# EAGLE design Game of Life v2 (EAGLE 9.6.2)
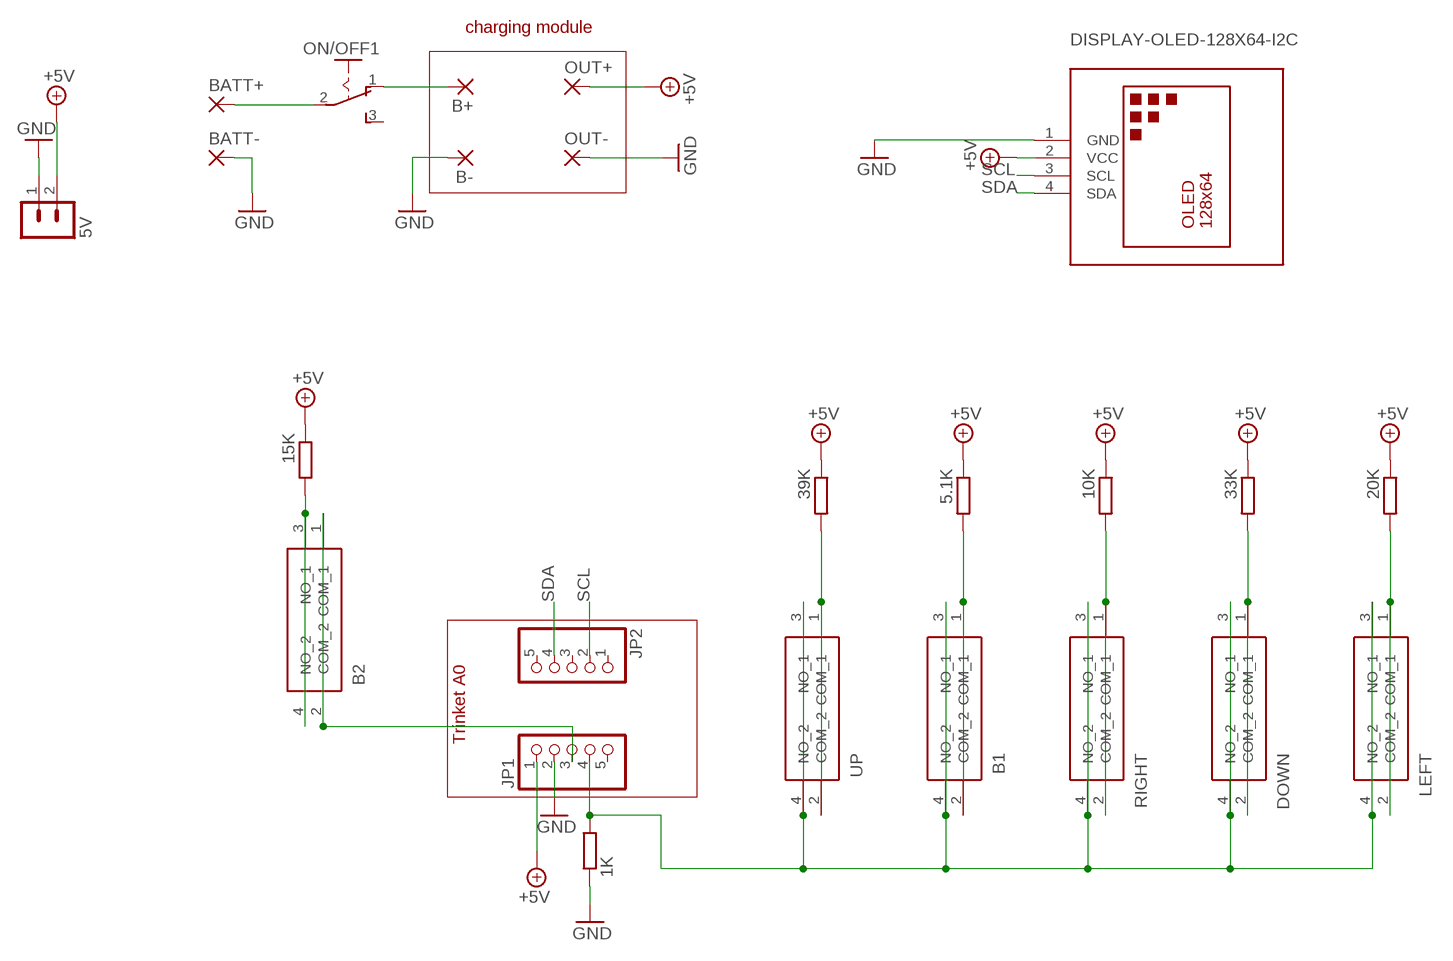
[diagram p0: schematic, sheet 1]

## Parts
5V  B2B-PH-K-S  [B2B-PH-K-S]
B1  101-0364-EV  [1010364EV]
B2  101-0364-EV  [1010364EV]
B+  SMD5  [SMD2,54-5,08]
B-  SMD5  [SMD2,54-5,08]
BATT+  SMD5  [SMD2,54-5,08]
BATT-  SMD5  [SMD2,54-5,08]
DOWN  101-0364-EV  [1010364EV]
JP1  PINHD-1X5  [1X05]
JP2  PINHD-1X5  [1X05]
LEFT  101-0364-EV  [1010364EV]
ON/OFF1  M251  [M251]
OUT+  SMD5  [SMD2,54-5,08]
OUT-  SMD5  [SMD2,54-5,08]
R1  1K  R-EU_0207/10  [0207/10]
R2  20K  R-EU_0207/10  [0207/10]
R3  39K  R-EU_0207/10  [0207/10]
R4  10K  R-EU_0207/10  [0207/10]
R5  33K  R-EU_0207/10  [0207/10]
R6  5.1K  R-EU_0207/10  [0207/10]
R7  15K  R-EU_0207/10  [0207/10]
RIGHT  101-0364-EV  [1010364EV]
U$2  DISPLAY-OLED-128X64-I2C  [DISPLAY-OLED-128X64-I2C]
UP  101-0364-EV  [1010364EV]

## Nets
+5V: 5V.2 JP1.1 OUT+.1(P) R2.1 R3.1 R4.1 R5.1 R6.1 R7.1 U$2.2(VCC)
GND: 5V.1 B-.1(P) BATT-.1(P) JP1.2 OUT-.1(P) R1.1 U$2.1(GND)
N$1: DOWN.1(COM_1) DOWN.2(COM_2) R5.2
N$2: R3.2 UP.1(COM_1) UP.2(COM_2)
N$3: R4.2 RIGHT.1(COM_1) RIGHT.2(COM_2)
N$4: B1.3(NO_1) B1.4(NO_2) DOWN.3(NO_1) DOWN.4(NO_2) JP1.4 LEFT.3(NO_1) LEFT.4(NO_2) R1.2 RIGHT.3(NO_1) RIGHT.4(NO_2) UP.3(NO_1) UP.4(NO_2)
N$5: LEFT.1(COM_1) LEFT.2(COM_2) R2.2
N$6: B1.1(COM_1) B1.2(COM_2) R6.2
N$7: B2.1(COM_1) B2.2(COM_2) JP1.3
N$8: BATT+.1(P) ON/OFF1.2(P)
N$9: B+.1(P) ON/OFF1.1(O)
N$10: B2.3(NO_1) B2.4(NO_2) R7.2
SCL: JP2.2 U$2.3(SCL)
SDA: JP2.4 U$2.4(SDA)
Unconnected: JP1.5 JP2.1 JP2.3 JP2.5 ON/OFF1.3(S)

## Notes on the sheet
- charging module
- Trinket A0

## Library data of the parts
5V = con-JST PH:B2B-PH: JST PH series header 2.00mm pitch disconnectable crimp style connectors, vertical (side entry type), 2 pins
B1 B2 DOWN LEFT RIGHT UP = Switch_Omron_SMD:101-0364-EV: Tactile Switches TACTILE SWITCH 6X6MM Source: Datasheet <https://componentsearchengine.com/Datasheets/1/101-0364-EV.pdf>; DESCRIPTION: Tactile Switches TACTILE SWITCH 6X6MM; HEIGHT: 2mm; MANUFACTURER_NAME: Mountain Switch; MANUFACTURER_PART_NUMBER: 101-0364-EV; MOUSER_PART_NUMBER: 101-0364-EV; MOUSER_PRICE-STOCK: https://www.mouser.co.uk/ProductDetail/Mountain-Switch/101-0364-EV?qs=Np9hobi9ysLawDJP688e5g%3D%3D
B+ B- BATT+ BATT- OUT+ OUT- = wirepad:SMD5: SMD PAD
JP1 JP2 = pinhead:PINHD-1X5: PIN HEADER
ON/OFF1 = switches M Dunn:M251: SLIDING SWITCH Mors, distributor Buerklin, 11G702
R1-R7 = rcl:R-EU_: RESISTOR, European symbol; SPICEPREFIX: R
U$2 = diy-modules:DISPLAY-OLED-128X64-I2C: 128x64 Dot Matrix OLED Module based on SSD1306 chip Variant with I2C interface More details available here: http://www.instructables.com/id/Monochrome-096-i2c-OLED-display-with-arduino-SSD13/ SSD1306 datasheet: https://cdn-shop.adafruit.com/datasheets/SSD1306.pdf Click here to find device on ebay.com <http://www.ebay.com/sch/oled+display+128x64+iic> Note: There are two variants: I2C and SPI. Search for the proper version.

## Board
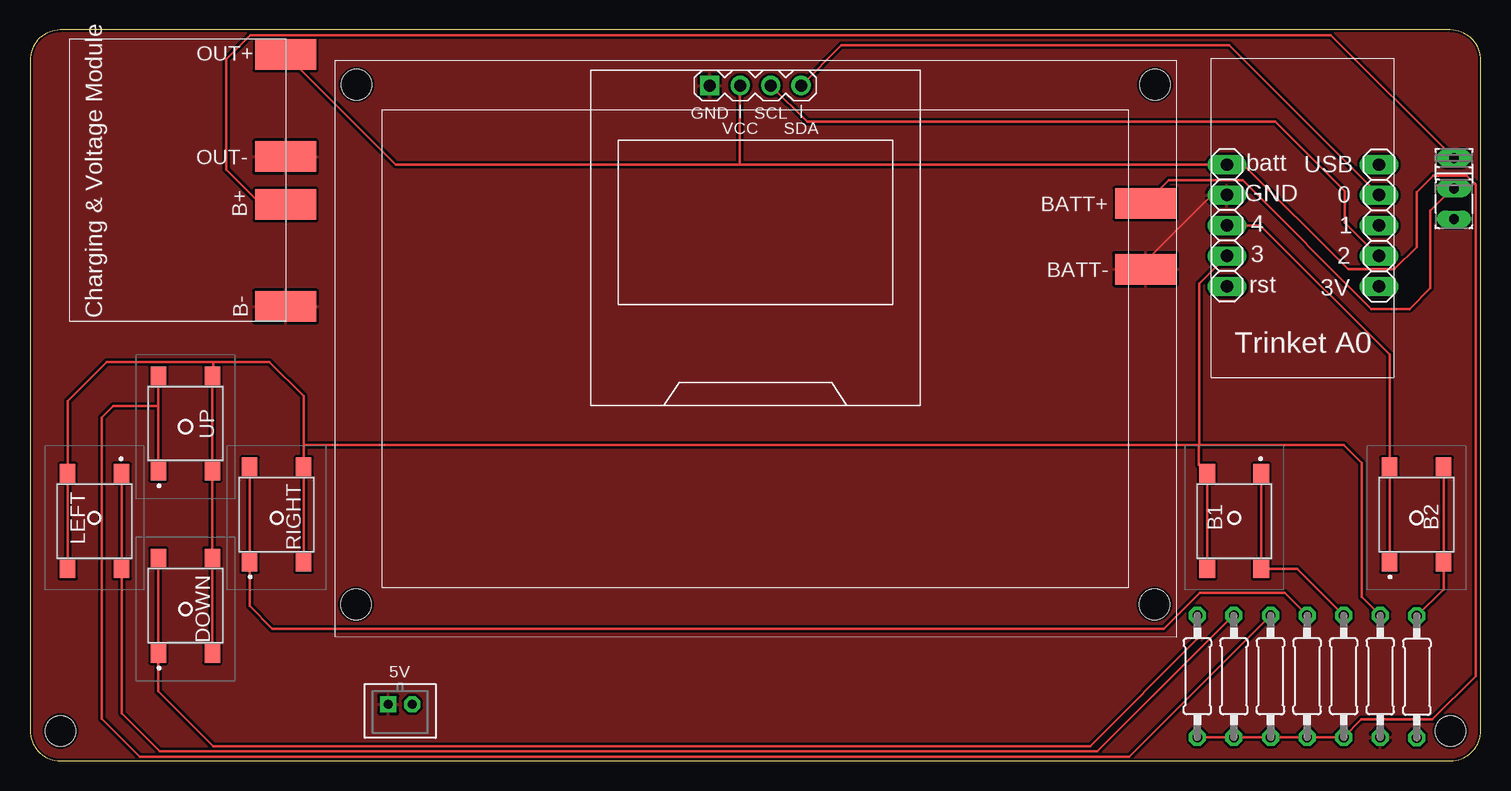
[diagram p1: board, top side]
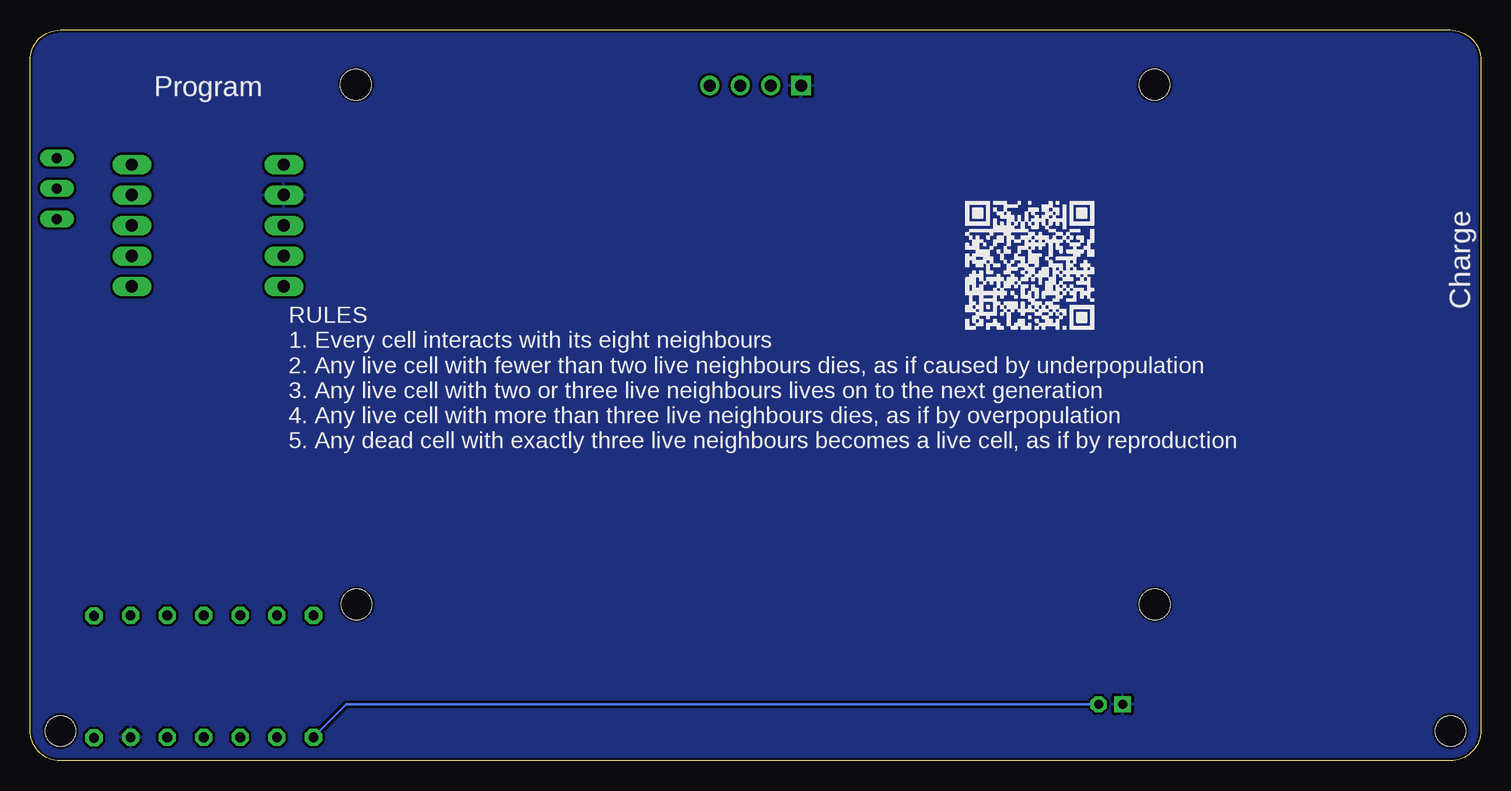
[diagram p2: board, bottom side, seen from below]

Size 120.9 x 60.95 mm. Coordinates in mm from the lower left corner, seen from the top.
Outline: 120.9,2.54 120.9,58.41 arc90 118.36,60.95 2.54,60.95 arc90 0,58.41 0,2.54 arc90 2.54,0 118.36,0 arc90 120.9,2.54
Copper layers (1*16): Top 0.035mm / dielectric 1.5mm / Bottom 0.035mm
Design rules "SparkFun": minimum track width 8mil, minimum drill 20mil, track to track 8mil, track to pad 8mil, pad to pad 8mil, via to via 8mil, smd to smd 8mil, copper to edge 8mil, drill to drill 8mil, minimum pad ring 12mil, minimum via ring 10mil, stop-mask expansion 4mil, vias tented up to drill 20mil, thermal gap 10mil
Holes 2.54 mm at 27.2,56.39 93.75,56.39 93.7,13.06 27.18,13.06 2.54,2.49 118.36,2.49

### Footprints (pad centres in the part's own frame; a part is rotated, then mirrored left to right if it is on the bottom)
B2B-PH-K-S = drill 0.75 pad 1.3 square: 1 1,0 | drill 0.75 pad 1.3 octagon: 2 -1,0
1010364EV = smd 1.55 x 1.3: 1 -3.7,2.25; 2 4.25,2.25; 3 -3.7,-2.25; 4 4.25,-2.25
SMD2,54-5,08 = smd 2.54 x 5.08: 1 0,0
1X05 = drill 1.016 long: 1 -5.08,0; 2 -2.54,0; 3 0,0; 4 2.54,0; 5 5.08,0
M251 = drill 0.813 long: 1 -2.54,0; 2 0,0; 3 2.54,0
0207/10 = drill 0.813 octagon: 1 -5.08,0; 2 5.08,0
DISPLAY-OLED-128X64-I2C = drill 1 square: 1 -3.81,12.7 | drill 1: 2 -1.27,12.7; 3 1.27,12.7; 4 3.81,12.7

### Placement (x,y rotation side)
5V  30.86,4.72 180 top
B1  100.36,20.27 270 top
B2  115.54,20.27 90 top
B+  21.31,46.41 270 top
B-  21.31,37.9 270 top
BATT+  92.96,46.48 90 top
BATT-  92.96,41 90 top
DOWN  12.95,12.67 90 top
JP1  99.75,44.65 270 top
JP2  112.42,44.65 90 top
LEFT  5.38,20.27 270 top
ON/OFF1  118.67,47.73 270 top
OUT+  21.31,58.9 90 top
OUT-  21.31,50.39 270 top
R1  112.52,7.06 90 top
R2  100.33,7.06 90 top
R3  103.38,7.06 90 top
R4  106.43,7.06 90 top
R5  97.28,7.06 90 top
R6  109.47,7.06 90 top
R7  115.57,7.01 90 top
RIGHT  20.55,20.27 90 top
U$2  60.45,43.62 0 top
UP  12.95,27.86 90 top

### Tracks (layer width: path | path; a pad name or v marks a point on that pad's centre or on a via)
+5V
  Top 0.203: U$2.2 59.16,56.3 59.16,49.78 59.21,49.73 | 59.21,49.73 JP1.1 101.12,49.73 109.86,41 113.7,41 115.55,42.84 115.55,47.41 116.95,48.82 119.72,48.82 120.4,48.15 120.4,48.13 120.47,48.06 120.47,7.06 116.86,3.45 115.57,3.45 | 59.21,49.73 30.48,49.73 OUT+.1 | R5.1 R2.1 R3.1 R4.1 R6.1 110.95,3.45 115.57,3.45 | R7.1 115.57,3.45
  Bottom 0.203: 5V.2 94.54,4.72 R5.1
GND
  Top 0.203: JP1.2 98.48,47.19 92.96,41.68 BATT-.1
  pour Top: 0,60.93 120.9,60.93 120.9,0 0,0
  pour Bottom: 0,60.93 120.9,60.93 120.9,0 0,0
N$1
  Top 0.203: R5.2 97.28,10.16 88.34,1.22 15.28,1.22 10.7,5.8 DOWN.1 DOWN.2
N$2
  Top 0.203: UP.2 10.7,29.59 | 10.7,29.59 UP.1 | 10.7,29.59 6.93,29.59 5.99,28.65 5.99,3.51 9.15,0.36 91.59,0.36 R3.2
N$3
  Top 0.203: RIGHT.2 RIGHT.1 18.3,12.92 20.19,11.02 94.49,11.02 97.46,14 104.57,14 R4.2
N$4
  Top 0.203: 97.43,26.37 97.43,39.8 JP1.4 | R1.2 110.97,13.69 110.97,24.87 109.47,26.37 102.72,26.37 97.43,26.37 | 97.43,26.37 97.41,26.37 | RIGHT.3 RIGHT.4 22.8,26.37 | LEFT.4 LEFT.3 3.13,30.01 6.4,33.27 15.29,33.27 | 97.41,26.37 22.8,26.37 | 15.29,33.27 19.94,33.27 22.8,30.41 22.8,26.37 | UP.4 15.29,32.2 15.29,32.49 | 15.29,32.49 15.29,33.27 | B1.4 B1.3 97.41,24.67 97.41,26.37 | 15.29,32.49 15.2,32.4 UP.3 DOWN.4 DOWN.3
N$5
  Top 0.203: LEFT.1 LEFT.2 7.63,3.97 10.79,0.81 88.95,0.81 100.28,12.14 R2.2
N$6
  Top 0.203: B1.1 B1.2 105.6,16.02 R6.2
N$7
  Top 0.203: B2.1 B2.2 113.3,33.9 102.54,44.65 JP1.3
N$8
  Top 0.203: BATT+.1 94.89,48.41 101.06,48.41 111.78,37.69 114.96,37.69 116.69,39.43 116.69,45.9 118.52,47.73 ON/OFF1.2
N$9
  Top 0.203: ON/OFF1.1 108.41,60.53 18.36,60.53 16.36,58.52 16.36,49.3 19.25,46.41 B+.1
N$10
  Top 0.203: R7.2 117.8,14.32 B2.3 B2.4
SCL
  Top 0.203: U$2.3 64.76,53.29 103.78,53.29 109.55,47.52 109.55,44.91 112.34,42.11 JP2.2
SDA
  Top 0.203: U$2.4 67.61,59.68 99.94,59.68 JP2.4

### Text on the board
tPlace: batt | USB | GND | 0 | 4 | 1 | 3 | 2 | rst | 3V | Charging & Voltage Module | Trinket A0
bPlace: Program | Charge | RULES / 1. Every cell interacts with its eight neighbours / 2. Any live cell with fewer than two live neighbours dies, as if caused by underpopulation / 3. Any live cell with two or three live neighbours lives on to the next generation / 4. Any live cell with more than three live neighbours dies, as if by overpopulation / 5. Any dead cell with exactly three live neighbours becomes a live cell, as if by reproduction